# Altium schematic sheet Main.SchDoc
size A
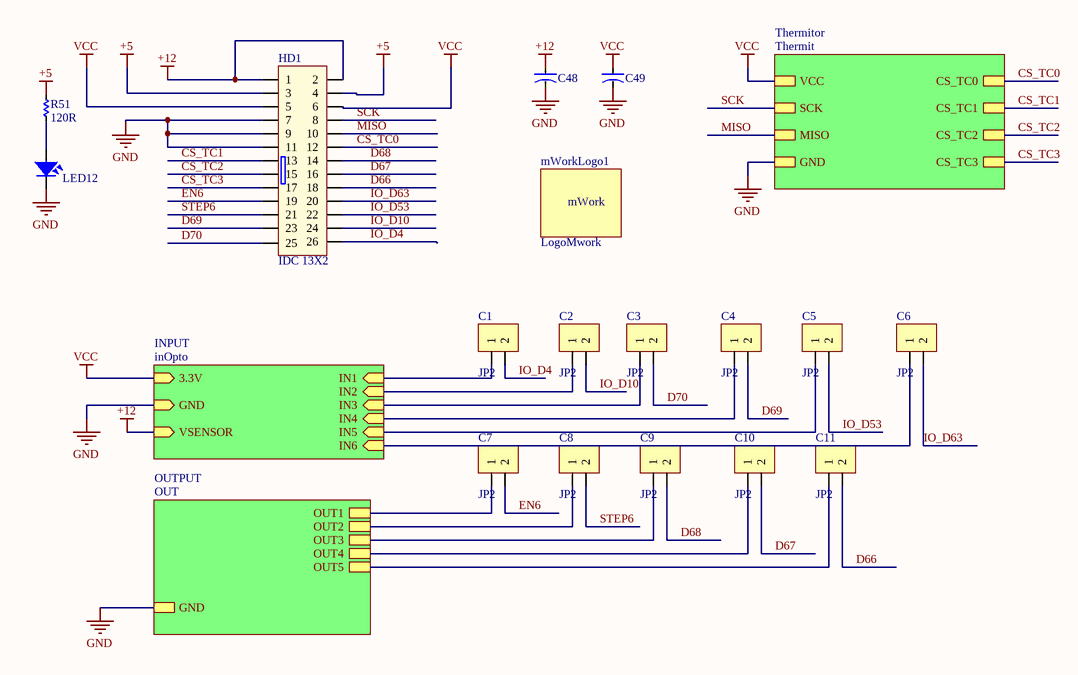
[diagram p0: Main.SchDoc]

## Parts
C1  JP2  [JP2-CLOSED]
C2  JP2  [JP2-CLOSED]
C3  JP2  [JP2-CLOSED]
C4  JP2  [JP2-CLOSED]
C5  JP2  [JP2-CLOSED]
C6  JP2  [JP2-CLOSED]
C7  JP2  [JP2-CLOSED]
C8  JP2  [JP2-CLOSED]
C9  JP2  [JP2-CLOSED]
C10  JP2  [JP2-CLOSED]
C11  JP2  [JP2-CLOSED]
C48  CN-ALU-SMD  [CAP-ALU-SMD-F]  (value not drawn)
C49  CN-ALU-SMD  [CAP-ALU-SMD-F]  (value not drawn)
HD1  IDC 13X2  [IDC26-B]
LED12  LED  [LED-0805-Red]  (value not drawn)
mWorkLogo1  LogoMwork  [LogoMwork30*12]
R51  120R  [RES-SMD-0603_BIG]

## Sub-sheets
INPUT = inOpto: 3.3V (in), VSENSOR (in), GND (in), IN1 (in), IN4 (in), IN3 (in), IN5 (in), IN6 (in), IN2 (in)
OUTPUT = OUT: OUT5, OUT4, OUT1, OUT2, OUT3, GND
Thermitor = Thermit: VCC, SCK, MISO, CS_TC0, CS_TC1, GND, CS_TC2, CS_TC3

## Nets
+5: HD1.3 HD1.4 R51.2
+12: C48.1 HD1.1 HD1.2 ; sheet INPUT/VSENSOR
GND: C48.2 C49.2 HD1.7 HD1.9 HD1.11 LED12.2 ; sheet Thermitor/GND, sheet INPUT/GND, sheet OUTPUT/GND
VCC: C49.1 HD1.5 HD1.6 ; sheet Thermitor/VCC, sheet INPUT/3.3V
CS_TC0: HD1.12 ; sheet Thermitor/CS_TC0
CS_TC1: HD1.13 ; sheet Thermitor/CS_TC1
CS_TC2: HD1.15 ; sheet Thermitor/CS_TC2
CS_TC3: HD1.17 ; sheet Thermitor/CS_TC3
D66: C11.2 HD1.18
D67: C10.2 HD1.16
D68: C9.2 HD1.14
D69: C4.2 HD1.23
D70: C3.2 HD1.25
EN6: C7.2 HD1.19
IO_D4: C1.2 HD1.26
IO_D10: C2.2 HD1.24
IO_D53: C5.2 HD1.22
IO_D63: C6.2 HD1.20
MISO: HD1.10 ; sheet Thermitor/MISO
SCK: HD1.8 ; sheet Thermitor/SCK
STEP6: C8.2 HD1.21
NetC1_1: C1.1 ; sheet INPUT/IN1
NetC2_1: C2.1 ; sheet INPUT/IN2
NetC3_1: C3.1 ; sheet INPUT/IN3
NetC4_1: C4.1 ; sheet INPUT/IN4
NetC5_1: C5.1 ; sheet INPUT/IN5
NetC6_1: C6.1 ; sheet INPUT/IN6
NetC7_1: C7.1 ; sheet OUTPUT/OUT1
NetC8_1: C8.1 ; sheet OUTPUT/OUT2
NetC9_1: C9.1 ; sheet OUTPUT/OUT3
NetC10_1: C10.1 ; sheet OUTPUT/OUT4
NetC11_1: C11.1 ; sheet OUTPUT/OUT5
NetLED12_1: LED12.1 R51.1

## Notes on the sheet
- (in symbol LogoMwork) mWork

## Library data of the parts
C1-C11 = JP2: WR-PHD 2.54 mm Angled Socket Header; Manufacturer: W¨¹rth Elektronik eiSos GmbH; partNo: 613002143121; ComponentLink1 Description: Manufacturer; ComponentLink2 Description: Datasheet; NoPins: 02; Created Date: 29 March 2013; ComponentLink1URL: http://www.we-online.com; ComponentLink2URL: http://katalog.we-online.de/em/datasheet/6130xx143121.pdf; Created by: Karrer Zheng
C48 C49 = CN-ALU-SMD: Polarized Capacitor (Axial); Published: 8-Jun-2000; LatestRevisionDate: 17-Jul-2002; LatestRevisionNote: Re-released for DXP Platform.; PackageReference: POLAR0.8; Publisher: Altium Limited
HD1 = IDC 13X2: Value: Header 5x2
LED12 = LED SMD: Value: LED 3 - 5 ly 2 Colour
R51 = R